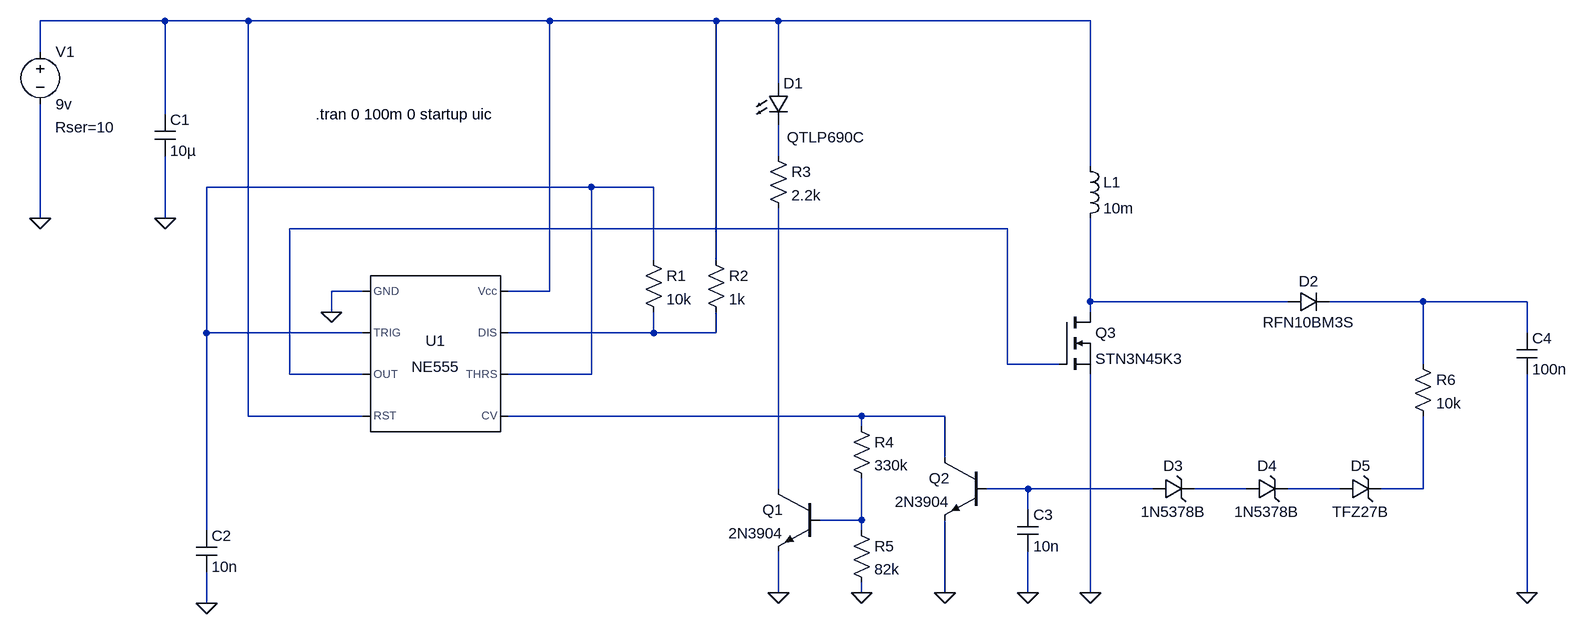
[diagram p0: schematic hv-power-supply-200v.asc]
hv-power-supply-200v.asc, the LTspice schematic file:
Version 4
SHEET 1 3720 680
WIRE -256 -352 -448 -352
WIRE -128 -352 -256 -352
WIRE 336 -352 -128 -352
WIRE 592 -352 336 -352
WIRE 688 -352 592 -352
WIRE 1168 -352 688 -352
WIRE -448 -304 -448 -352
WIRE 688 -256 688 -352
WIRE -256 -208 -256 -352
WIRE 688 -144 688 -192
WIRE 1168 -128 1168 -352
WIRE 400 -96 -192 -96
WIRE 496 -96 400 -96
WIRE -448 -48 -448 -224
WIRE -256 -48 -256 -144
WIRE 1040 -32 -64 -32
WIRE 496 16 496 -96
WIRE 592 16 592 -352
WIRE 48 64 0 64
WIRE 336 64 336 -352
WIRE 336 64 272 64
WIRE 1168 80 1168 -48
WIRE 1472 80 1168 80
WIRE 1680 80 1536 80
WIRE 1840 80 1680 80
WIRE 0 96 0 64
WIRE 1168 96 1168 80
WIRE -192 128 -192 -96
WIRE 48 128 -192 128
WIRE 496 128 496 96
WIRE 496 128 272 128
WIRE 592 128 592 96
WIRE 592 128 496 128
WIRE 1840 128 1840 80
WIRE 1040 176 1040 -32
WIRE 1120 176 1040 176
WIRE 1680 176 1680 80
WIRE -64 192 -64 -32
WIRE 48 192 -64 192
WIRE 400 192 400 -96
WIRE 400 192 272 192
WIRE -128 256 -128 -352
WIRE 48 256 -128 256
WIRE 816 256 272 256
WIRE 944 256 816 256
WIRE 816 272 816 256
WIRE 944 320 944 256
WIRE 688 368 688 -64
WIRE 1072 368 1008 368
WIRE 1264 368 1072 368
WIRE 1408 368 1328 368
WIRE 1552 368 1472 368
WIRE 1680 368 1680 256
WIRE 1680 368 1616 368
WIRE 1072 400 1072 368
WIRE 816 416 816 352
WIRE 816 416 752 416
WIRE -192 432 -192 128
WIRE 816 432 816 416
WIRE 688 528 688 464
WIRE 816 528 816 512
WIRE 944 528 944 416
WIRE 1072 528 1072 464
WIRE 1168 528 1168 192
WIRE 1840 528 1840 192
WIRE -192 544 -192 496
FLAG -448 -48 0
FLAG 0 96 0
FLAG 1168 528 0
FLAG 1840 528 0
FLAG -192 544 0
FLAG -256 -48 0
FLAG 688 528 0
FLAG 1072 528 0
FLAG 944 528 0
FLAG 816 528 0
SYMBOL Misc\\NE555 160 160 R0
SYMATTR InstName U1
SYMBOL voltage -448 -320 R0
WINDOW 123 0 0 Left 0
WINDOW 39 23 132 Left 2
SYMATTR SpiceLine Rser=10
SYMATTR InstName V1
SYMATTR Value 9v
SYMBOL nmos 1120 96 R0
SYMATTR InstName Q3
SYMATTR Value STN3N45K3
SYMBOL ind 1152 -144 R0
SYMATTR InstName L1
SYMATTR Value 10m
SYMATTR SpiceLine Ipk=250m Rser=14.6 Rpar=0 Cpar=0
SYMBOL cap 1824 128 R0
SYMATTR InstName C4
SYMATTR Value 100n
SYMATTR SpiceLine Rser=1u Lser=1n Rpar=100000k
SYMBOL res 480 0 R0
SYMATTR InstName R1
SYMATTR Value 10k
SYMBOL res 576 0 R0
SYMATTR InstName R2
SYMATTR Value 1k
SYMBOL cap -208 432 R0
SYMATTR InstName C2
SYMATTR Value 10n
SYMBOL cap -272 -208 R0
SYMATTR InstName C1
SYMATTR Value 10µ
SYMBOL zener 1264 384 R270
WINDOW 0 36 32 VTop 2
WINDOW 3 -4 32 VBottom 2
SYMATTR InstName D3
SYMATTR Value 1N5378B
SYMBOL zener 1408 384 R270
WINDOW 0 36 32 VTop 2
WINDOW 3 -4 32 VBottom 2
SYMATTR InstName D4
SYMATTR Value 1N5378B
SYMBOL diode 1472 96 R270
WINDOW 0 32 32 VTop 2
WINDOW 3 0 32 VBottom 2
SYMATTR InstName D2
SYMATTR Value RFN10BM3S
SYMBOL zener 1552 384 R270
WINDOW 0 36 32 VTop 2
WINDOW 3 -4 32 VBottom 2
SYMATTR InstName D5
SYMATTR Value TFZ27B
SYMBOL LED 672 -256 R0
WINDOW 3 29 83 Left 2
SYMATTR Value QTLP690C
SYMATTR InstName D1
SYMBOL cap 1056 400 R0
SYMATTR InstName C3
SYMATTR Value 10n
SYMATTR SpiceLine Rpar=10G
SYMBOL npn 752 368 M0
SYMATTR InstName Q1
SYMATTR Value 2N3904
SYMBOL npn 1008 320 M0
SYMATTR InstName Q2
SYMATTR Value 2N3904
SYMBOL res 672 -160 R0
SYMATTR InstName R3
SYMATTR Value 2.2k
SYMBOL res 800 256 R0
SYMATTR InstName R4
SYMATTR Value 330k
SYMBOL res 1664 160 R0
SYMATTR InstName R6
SYMATTR Value 10k
SYMBOL res 800 416 R0
SYMATTR InstName R5
SYMATTR Value 82k
TEXT -24 -208 Left 2 !.tran 0 100m 0 startup uic

The netlist it stands for:
* hv-power-supply-200v.asc
XU1 0 N003 N004 N001 N008 N003 N007 N001 NE555  ; pins GND TRIG OUT RST CV THRS DIS Vcc
V1 N001 0 9v Rser=10
M§Q3 N005 N004 0 0 STN3N45K3
L1 N001 N005 10m Ipk=250m Rser=14.6 Rpar=0 Cpar=0
C4 N006 0 100n Rser=1u Lser=1n Rpar=100000k
R1 N003 N007 10k
R2 N001 N007 1k
C2 N003 0 10n
C1 N001 0 10µ
D3 N010 N011 1N5378B
D4 N011 N012 1N5378B
D2 N005 N006 RFN10BM3S
D5 N012 N013 TFZ27B
D1 N001 N002 QTLP690C
C3 N010 0 10n Rpar=10G
Q1 N009 N014 0 0 2N3904
Q2 N008 N010 0 0 2N3904
R3 N002 N009 2.2k
R4 N008 N014 330k
R6 N006 N013 10k
R5 N014 0 82k
.model D D
.lib standard.dio
.model NPN NPN
.model PNP PNP
.lib standard.bjt
.model NMOS NMOS
.model PMOS PMOS
.lib standard.mos
.tran 0 100m 0 startup uic
.lib NE555.sub
.backanno
.end